# Altium schematic sheet Configurations.SchDoc
size Letter; DocumentNumber: 3; SheetNumber: 3; SheetTotal: 11; Pagesize: Letter
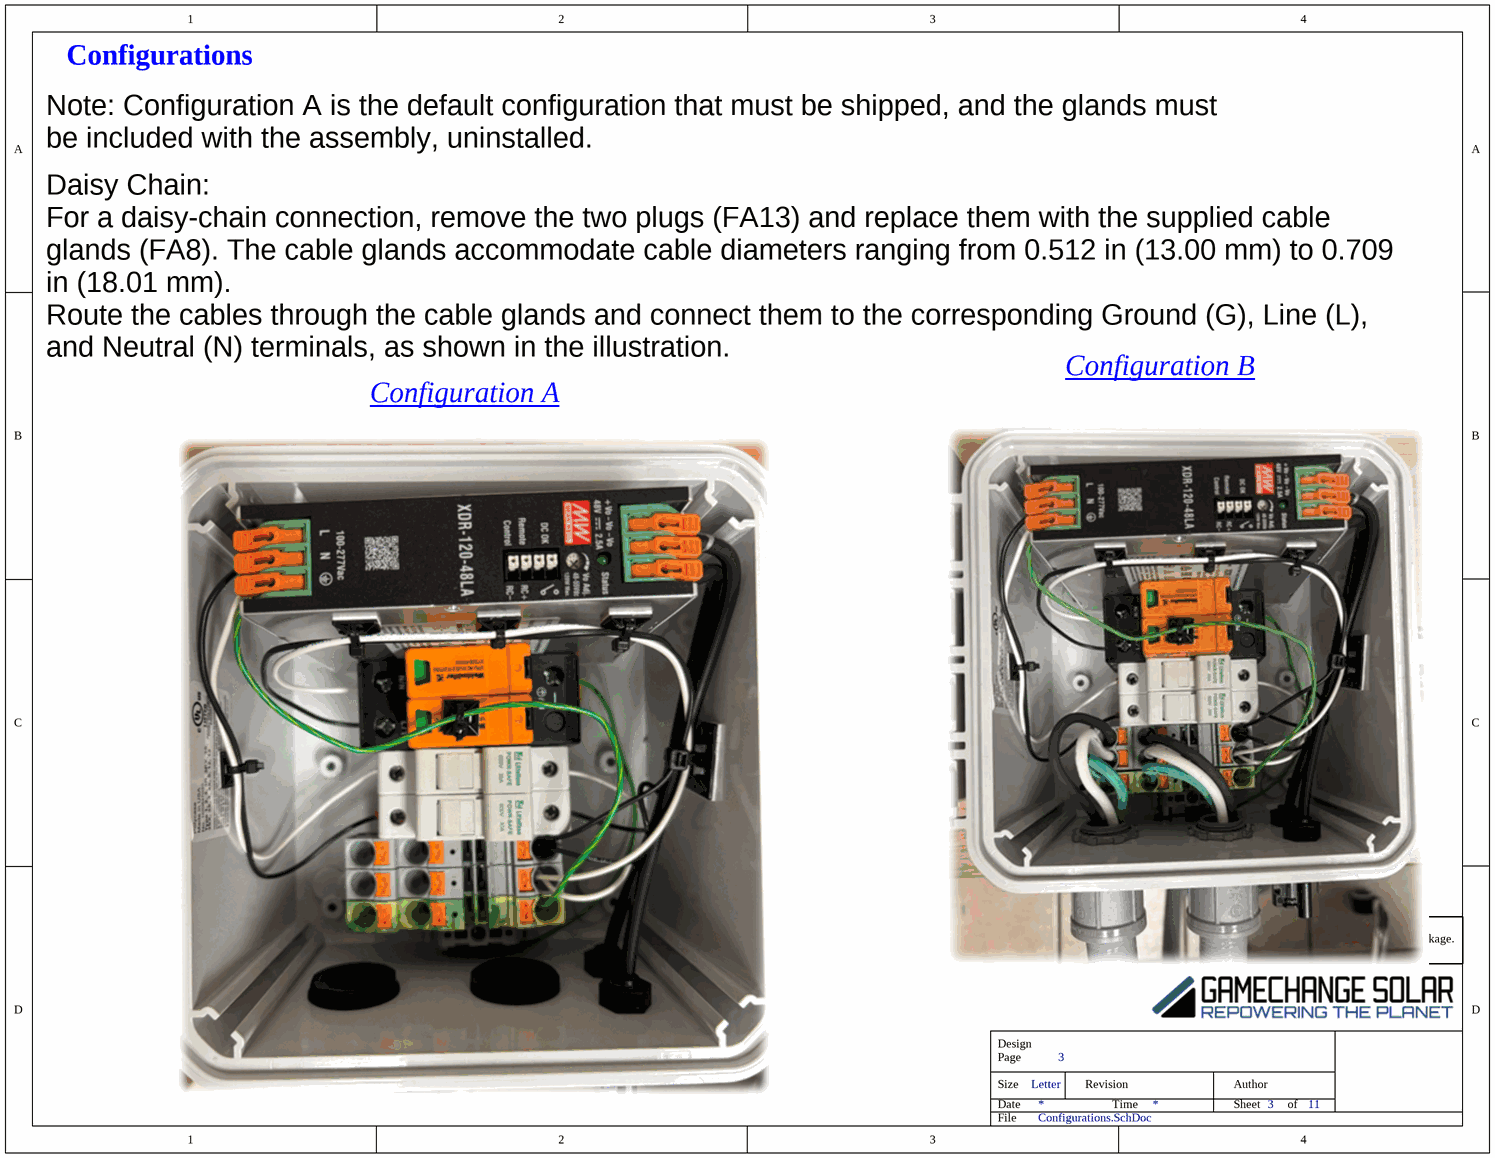
[diagram p0: Configurations.SchDoc]

## Notes on the sheet
- Configurations
- Note: Configuration A is the default configuration that must be shipped, and the glands must be included with the assembly, uninstalled.
- Daisy Chain:
  For a daisy-chain connection, remove the two plugs (FA13) and replace them with the supplied cable glands (FA8). The cable glands accommodate cable diameters ranging from 0.512 in (13.00 mm) to 0.709 in (18.01 mm).
  Route the cables through the cable glands and connect them to the corresponding Ground (G), Line (L), and Neutral (N) terminals, as shown in the illustration.
- Configuration A
- Configuration B
- ---UNLESS OTHERWISE NOTED ---
  1. All resistors and capacitors are 0603 package.
  2. All resistor tolerances are 1%.
- Design
- Size
- Date
- Page
- Revision
- Time
- Sheet
- Author
- of
- File